# Altium schematic sheet Differential Opamp.SchDoc
size B; SheetNumber: 6; SheetTotal: 7
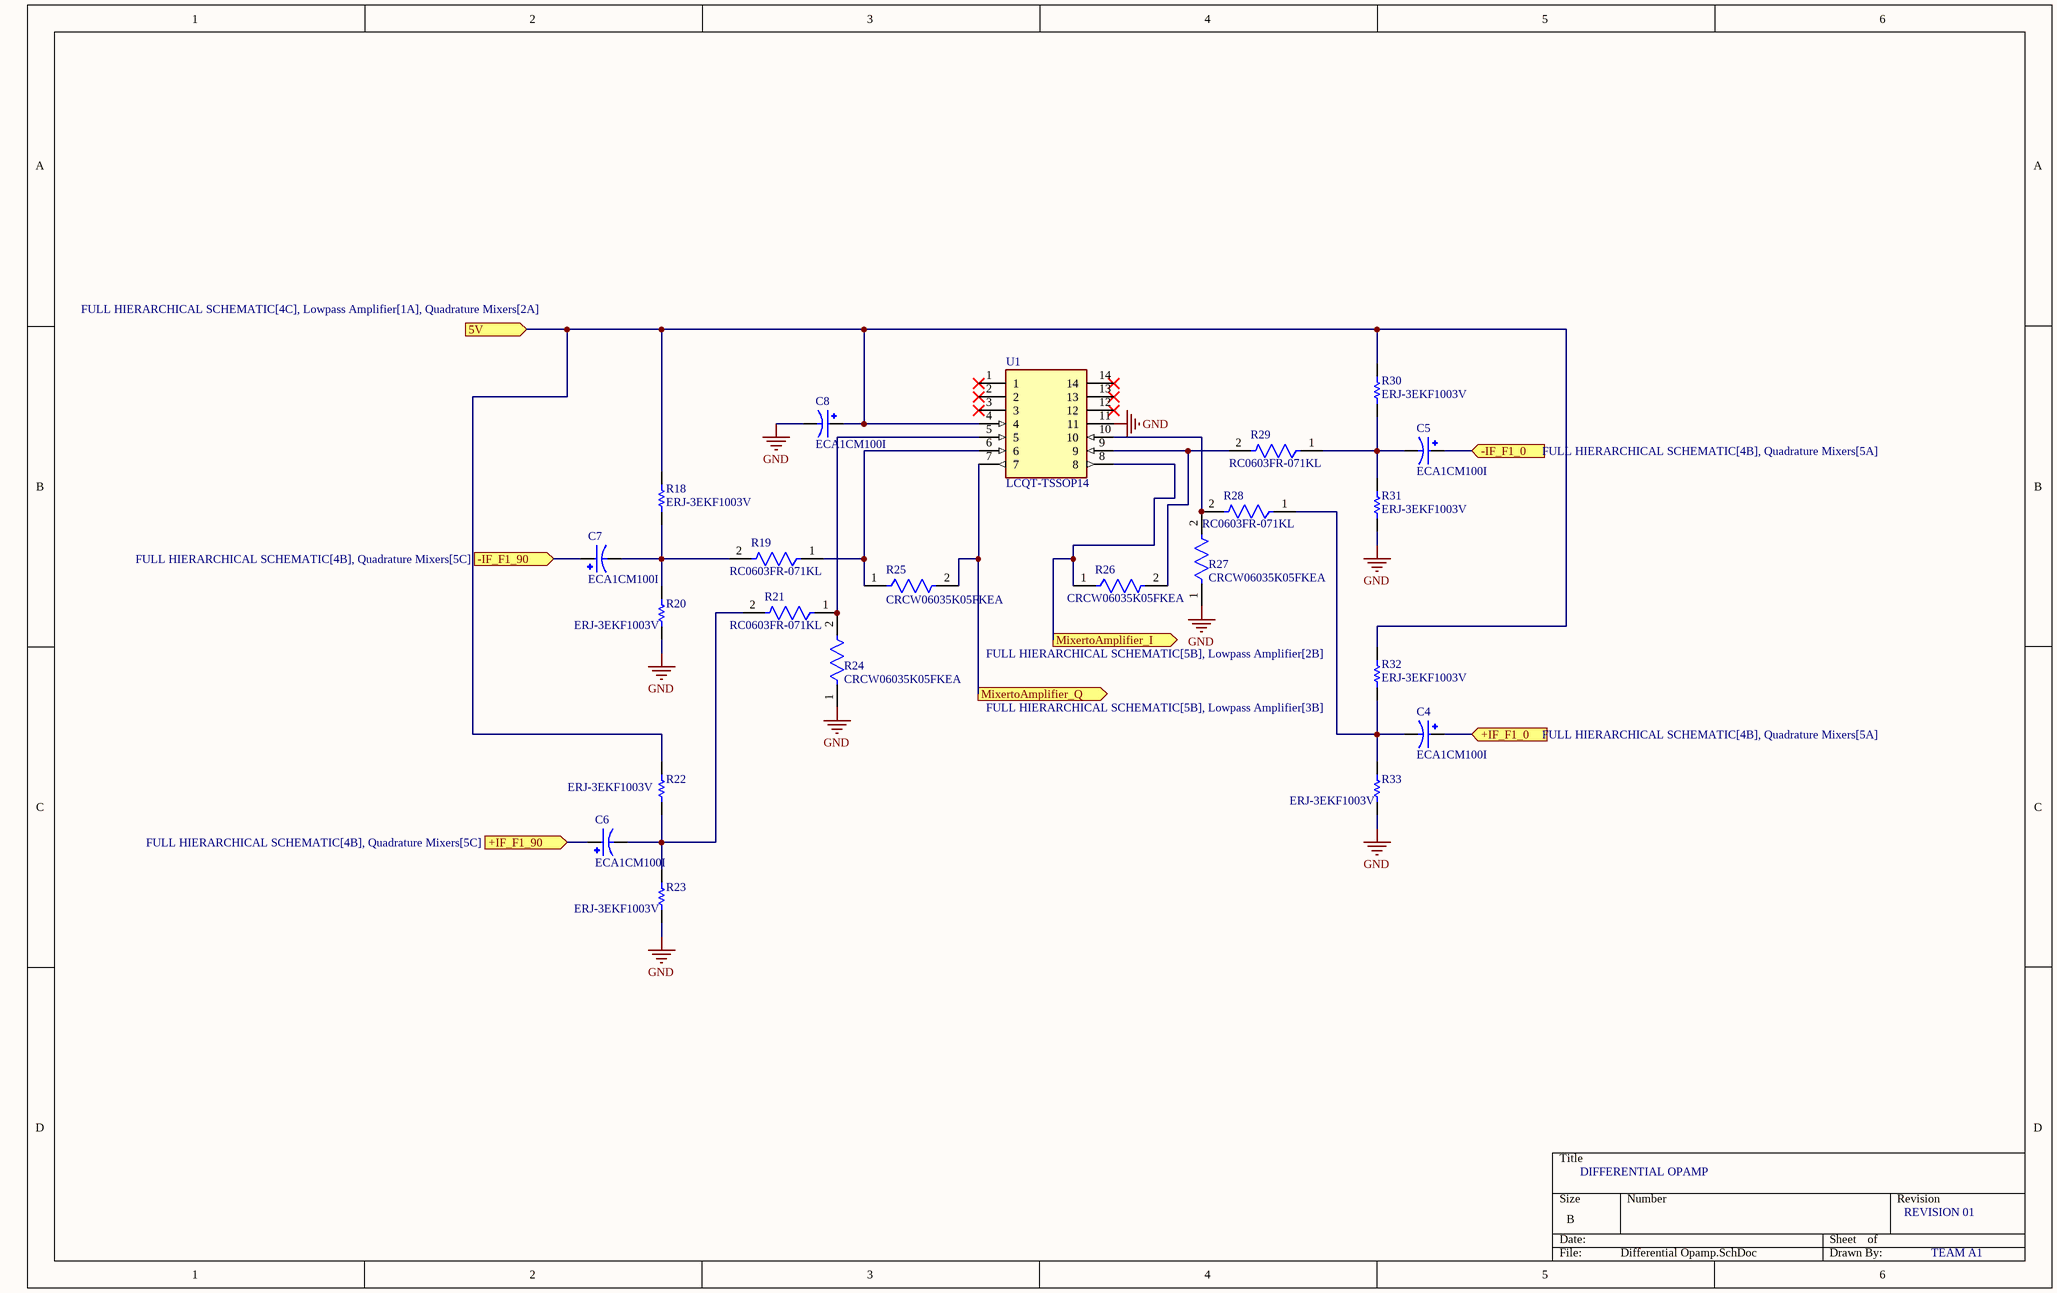
[diagram p0: Differential Opamp.SchDoc]

## Parts
C4  ECA1CM100I  [CAPPRD250W50D500H1100]
C5  ECA1CM100I  [CAPPRD250W50D500H1100]
C6  ECA1CM100I  [CAPPRD250W50D500H1100]
C7  ECA1CM100I  [CAPPRD250W50D500H1100]
C8  ECA1CM100I  [CAPPRD250W50D500H1100]
R18  ERJ-3EKF1003V  [RESC1608X55X30ML15T15]
R19  RC0603FR-071KL  [FP-RC0603-0_55-IPC_C]
R20  ERJ-3EKF1003V  [RESC1608X55X30ML15T15]
R21  RC0603FR-071KL  [FP-RC0603-0_55-IPC_C]
R22  ERJ-3EKF1003V  [RESC1608X55X30ML15T15]
R23  ERJ-3EKF1003V  [RESC1608X55X30ML15T15]
R24  CRCW06035K05FKEA  [FP-CRCW0603-e3-IPC_B]
R25  CRCW06035K05FKEA  [FP-CRCW0603-e3-IPC_B]
R26  CRCW06035K05FKEA  [FP-CRCW0603-e3-IPC_B]
R27  CRCW06035K05FKEA  [FP-CRCW0603-e3-IPC_B]
R28  RC0603FR-071KL  [FP-RC0603-0_55-IPC_C]
R29  RC0603FR-071KL  [FP-RC0603-0_55-IPC_C]
R30  ERJ-3EKF1003V  [RESC1608X55X30ML15T15]
R31  ERJ-3EKF1003V  [RESC1608X55X30ML15T15]
R32  ERJ-3EKF1003V  [RESC1608X55X30ML15T15]
R33  ERJ-3EKF1003V  [RESC1608X55X30ML15T15]
U1  LCQT-TSSOP14  [ARIES_LCQT-TSSOP14]

## Ports
5V (in, see FULL HIERARCHICAL SCHEMATIC[4C], Lowpass Amplifier[1A], Quadrature Mixers[2A]), +IF_F1_0 (in, see FULL HIERARCHICAL SCHEMATIC[4B], Quadrature Mixers[5A]), +IF_F1_90 (in, see FULL HIERARCHICAL SCHEMATIC[4B], Quadrature Mixers[5C]), -IF_F1_0 (in, see FULL HIERARCHICAL SCHEMATIC[4B], Quadrature Mixers[5A]), -IF_F1_90 (in, see FULL HIERARCHICAL SCHEMATIC[4B], Quadrature Mixers[5C]), MixertoAmplifier_I (out, see FULL HIERARCHICAL SCHEMATIC[5B], Lowpass Amplifier[2B]), MixertoAmplifier_Q (out, see FULL HIERARCHICAL SCHEMATIC[5B], Lowpass Amplifier[3B])

## Nets
GND: C8.N R20.1 R23.1 R24.1 R27.1 R31.1 R33.1 U1.11
5V: C8.P R18.2 R22.2 R30.2 R32.2 U1.4 ; port 5V
+IF_F1_0: C4.P ; port +IF_F1_0
+IF_F1_90: C6.P ; port +IF_F1_90
-IF_F1_0: C5.P ; port -IF_F1_0
-IF_F1_90: C7.P ; port -IF_F1_90
MixertoAmplifier_I: R26.1 U1.8 ; port MixertoAmplifier_I
MixertoAmplifier_Q: R25.2 U1.7 ; port MixertoAmplifier_Q
NetC4_N: C4.N R28.1 R32.1 R33.2
NetC5_N: C5.N R29.1 R30.1 R31.2
NetC6_N: C6.N R21.2 R22.1 R23.2
NetC7_N: C7.N R18.1 R19.2 R20.2
NetR19_1: R19.1 R25.1 U1.6
NetR21_1: R21.1 R24.2 U1.5
NetR26_2: R26.2 R29.2 U1.9
NetR27_2: R27.2 R28.2 U1.10

Not connected (* = marked no-connect by the designer): U1 1* 2* 3* 12* 13* 14*

## Notes on the sheet
- DIFFERENTIAL OPAMP
- REVISION 01
- TEAM A1

## Library data of the parts
C4-C8 = ECA1CM100I: 10ÂµF 16V Aluminum Electrolytic Capacitors Radial, Can 2000 Hrs @ 85Â°C; MF: Panasonic; SnapEDA_Link: https://www.snapeda.com/parts/ECA1CM100I/Panasonic/view-part/?ref=snap; Check_prices: https://www.snapeda.com/parts/ECA1CM100I/Panasonic/view-part/?ref=eda; MP: ECA1CM100I; Digi-Key_Part_Number: P19513TB-ND; Package: RADIAL-2 Panasonic; Value: *
R18 R20 R22 R23 R30-R33 = CMP-2000-00182-1: Manufacturer: Panasonic; Part Number: ERJ-3EKF1003V
R19 R21 R28 R29 = CMP-1659-00009-5: RES 1K OHM 1% 1/10W 0603; Resistance: 1kR; Voltage Rating: 50V; Power Rating: 100mW; Temperature Coefficient: 100ppm/°C; Military Standard: Not; REACH SVHC: No SVHC; Size Code: 0603; Features: Moisture Resistant; Number of Terminations: 2; Technology: THICK FILM; Series: RC; Case Code (Metric): 1608; Resistance Tolerance: 1%; Resistor Type: Thick Film; Termination: SMD/SMT; Contact Plating: Tin; Radiation Hardening: No; Min Operating Temperature: -55°C; Max Operating Temperature: 155°C; Packaging: Tape and Reel; Max Power Dissipation: 100mW; RoHS Compliant: Yes; Height: 0.45mm; Lead Free: Lead Free; Case/Package: 0603; Length: 1.6mm; Tolerance: 1%; Case Code (Imperial): 0603; Construction: Rectangular; Depth: 0.8mm
R24-R27 = CMP-02407-010650-1: RES Thick Film, 5.05kΩ, 1%, 0.1W, 100ppm/°C, 0603; Power Rating: 100mW; Voltage Rating: 75V; Resistance: 5.05kR; Case Code (Metric): 1608; Case/Package: 0603; Package Quantity: 5000; Max Operating Temperature: 155°C; Min Operating Temperature: -55°C; Features: Automotive AEC-Q200; Case Code (Imperial): 0603; Weight: 7.1E-05oz; Number of Terminations: 2; Height: 0.02inch; Tolerance: 1%; Temperature Coefficient: 100ppm/°C; Composition: Thick Film; Width: 0.85mm; Voltage Rating (DC): 75V; Number of Pins: 2; Max Power Dissipation: 100mW; Termination: SMD/SMT; Length: 0.061inch; Packaging: Tape and Reel; Lead Free: Lead Free
U1 = LCQT-TSSOP14: SOCKET ADAPTER TSSOP TO 14DIP; MF: Aries Electronics; SnapEDA_Link: https://www.snapeda.com/parts/LCQT-TSSOP14/Aries+Electronics/view-part/?ref=snap; Package: TSSOP-14 Aries; Value: *; MP: LCQT-TSSOP14; Check_prices: https://www.snapeda.com/parts/LCQT-TSSOP14/Aries+Electronics/view-part/?ref=eda